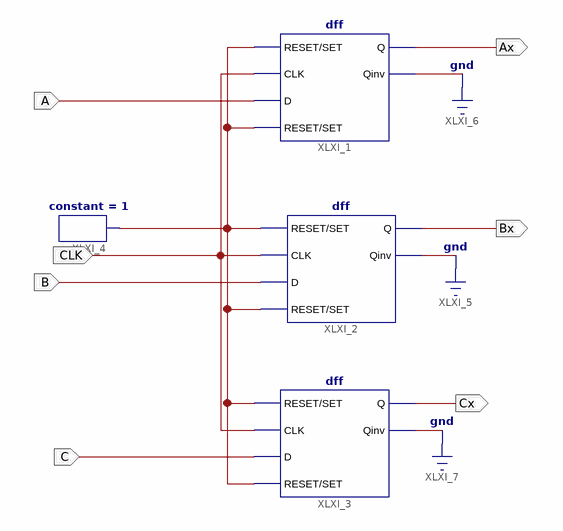
[diagram p0: schematic sheet 1]
// Xilinx ISE schematic datasyncer.sch (artix7) as structural Verilog: 4 symbols, 7 ports
module datasyncer (
  input  CLK,
  input  A,
  input  B,
  input  C,
  output Bx,
  output Ax,
  output Cx
);

  wire XLXN_1;

  dff XLXI_1 (.CLK(CLK), .D(A), .Q(Ax), .Qinv(1'b0), .RESET(XLXN_1), .SET(XLXN_1));
  dff XLXI_2 (.CLK(CLK), .D(B), .Q(Bx), .Qinv(1'b0), .RESET(XLXN_1), .SET(XLXN_1));
  dff XLXI_3 (.CLK(CLK), .D(C), .Q(Cx), .Qinv(1'b0), .RESET(XLXN_1), .SET(XLXN_1));
  constant #(.CValue("1")) XLXI_4 (.O(XLXN_1));
endmodule
